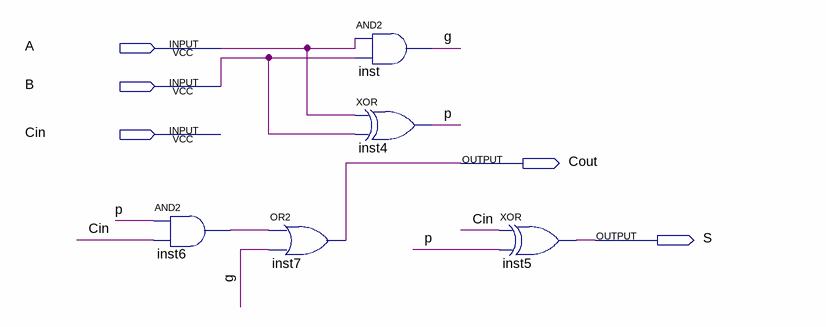
[diagram p0: schematic sheet]
// Quartus schematic FA.bdf as structural Verilog: 5 symbols, 5 pins
module FA (
  input  A,
  input  B,
  input  Cin,
  output Cout,
  output S
);

  wire g, inst6_out, p;

  and inst6 (inst6_out, p, Cin);
  or inst7 (Cout, inst6_out, g);
  and inst (g, A, B);
  xor inst4 (p, A, B);
  xor inst5 (S, Cin, p);
endmodule
